# EAGLE design wirelesscontroller (EAGLE 6.5.0)
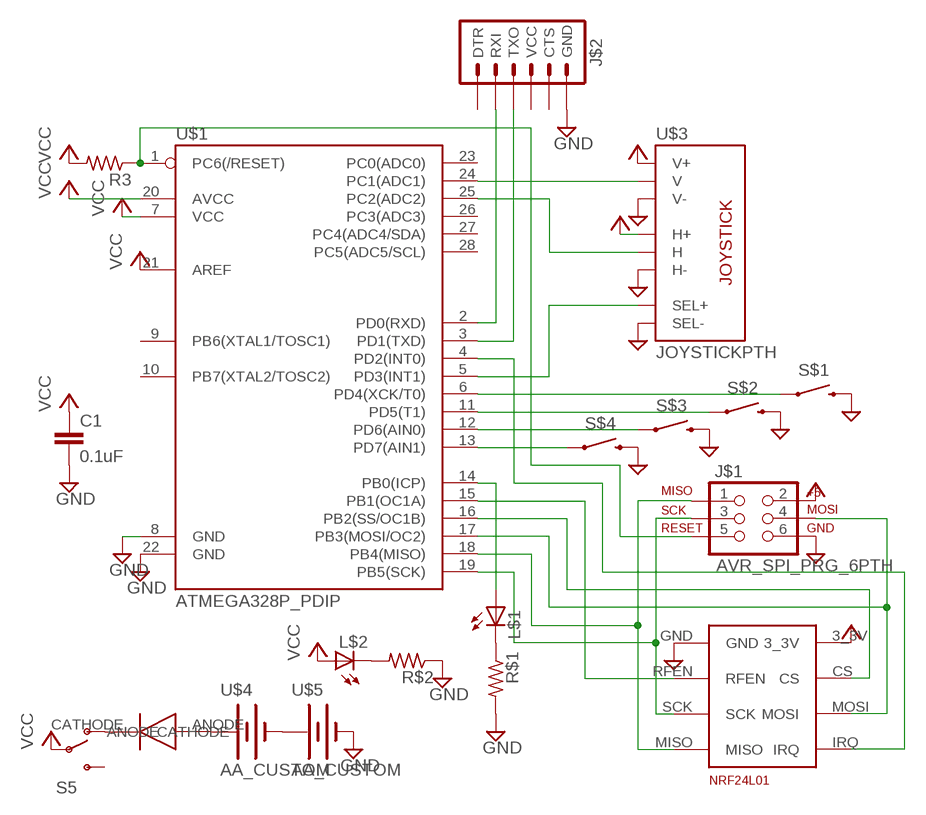
[diagram p0: schematic, sheet 1]

## Parts
C1  0.1uF  0.1UF-25V(+80/-20%)(0603)  [0603-CAP]
D$1  DIODE  [R0603]
J$1  AVR_SPI_PRG_6PTH  [2X3]
J$2  ARDUINO_SERIAL_PROGRAMPTH  [1X06]
L$1  LEDCHIPLED_0603  [CHIPLED_0603]
L$2  LEDCHIPLED_0603  [CHIPLED_0603]
R3  R-US_R0603  [R0603]
R$1  R-US_R0603  [R0603]
R$2  R-US_R0603  [R0603]
S5  SWITCH-SPDTPTH  [SWITCH-SPDT]
S$1  SWITCH-MOMENTARY-212MM  [TACTILE-PTH-12MM]
S$2  SWITCH-MOMENTARY-212MM  [TACTILE-PTH-12MM]
S$3  SWITCH-MOMENTARY-212MM  [TACTILE-PTH-12MM]
S$4  SWITCH-MOMENTARY-212MM  [TACTILE-PTH-12MM]
U$1  ATMEGA328P_PDIP  [DIL28-3]
U$2  NRF24L01_BRK  [4X2]
U$3  JOYSTICKPTH  [JOYSTICK]
U$4  AA_CUSTOM  [AACLIP]
U$5  AA_CUSTOM  [AACLIP]

## Nets
AX: U$1.25(PC2(ADC2)) U$3.H2(H)
AY: U$1.24(PC1(ADC1)) U$3.V2(V)
B1: S$1.1 U$1.6(PD4(XCK/T0))
B2: S$2.1 U$1.11(PD5(T1))
B3: S$3.1 U$1.12(PD6(AIN0))
B4: S$4.1 U$1.13(PD7(AIN1))
B5: U$1.5(PD3(INT1)) U$3.B1A(SEL+)
CS: U$1.16(PB2(SS/OC1B)) U$2.CS
GND: C1.2 J$1.6 J$2.6(GND) R$1.2 R$2.1 S$1.3 S$2.3 S$3.3 S$4.3 U$1.8(GND) U$1.22(GND) U$2.GND U$3.B2A(SEL-) U$3.H3(H-) U$3.V3(V-) U$5.-
MISO: J$1.1 U$1.18(PB4(MISO)) U$2.MISO
MOSI: J$1.4 U$1.17(PB3(MOSI/OC2)) U$2.MOSI
N$1: D$1.CATHODE S5.1(O)
N$2: U$4.- U$5.+
N$3: D$1.ANODE U$4.+
N$6: L$2.C R$2.2
N$7: L$1.C R$1.1
N$8: L$1.A U$1.14(PB0(ICP))
RESET: J$1.5 R3.1 U$1.1(PC6(/RESET))
RF_IRQ: U$1.4(PD2(INT0)) U$2.IRQ
RFEN: U$1.15(PB1(OC1A)) U$2.RFEN
RX: J$2.2(RXI) U$1.2(PD0(RXD))
SCK: J$1.3 U$1.19(PB5(SCK)) U$2.SCK
TX: J$2.3(TXO) U$1.3(PD1(TXD))
VCC: C1.1 J$1.2 L$2.A R3.2 S5.2(P) U$1.7(VCC) U$1.20(AVCC) U$1.21(AREF) U$2.3_3V U$3.H1(H+) U$3.V1(V+)
Unconnected: J$2.1(DTR) J$2.4(VCC) J$2.5(CTS) S5.3(S) U$1.9(PB6(XTAL1/TOSC1)) U$1.10(PB7(XTAL2/TOSC2)) U$1.23(PC0(ADC0)) U$1.26(PC3(ADC3)) U$1.27(PC4(ADC4/SDA)) U$1.28(PC5(ADC5/SCL))

## Library data of the parts
C1 = SparkFun-Capacitors:0.1UF-25V(+80/-20%)(0603): CAP-00810 Ceramic Standard decoupling cap; PROD_ID: CAP-00810
D$1 = battery:DIODE
J$1 = SparkFun-Connectors:AVR_SPI_PRG_6: AVR ISP 6 Pin This is the reduced ISP connector for AVR programming. Common on Arduino. This footprint will take up less PCB space and can be used with a 10-pin to 6-pin adapter such as SKU: BOB-08508
J$2 = SparkFun-Connectors:ARDUINO_SERIAL_PROGRAM: FTDI connector footprints
L$1 L$2 = led:LED: LED OSRAM: - CHIPLED LG R971, LG N971, LY N971, LG Q971, LY Q971, LO R971, LY R971 LH N974, LH R974 LS Q976, LO Q976, LY Q976 LO Q996 - Hyper CHIPLED LW Q18S LB Q993, LB Q99A, LB R99A - SideLED LS A670, LO A670, LY A670, LG A670, LP A670 LB A673, LV A673, LT A673, LW A673 LH A674 LY A675 LS A676, LA A676, LO A676, LY A676, LW A676 LS A679, LY A679, LG A679 - Hyper Micro SIDELED® LS Y876, LA Y876, LO Y876, LY Y876 LT Y87S - SmartLED LW L88C, LW L88S LB L89C, LB L89S, LG L890 LS L89K, LO L89K, LY L89K LS L896, LA L896, LO L896, LY L896 - TOPLED LS T670, LO T670, LY T670, LG T670, LP T670 LSG T670, LSP T670, LSY T670, LOP T670, LYG T670 LG T671, LOG T671, LSG T671 LB T673, LV T673, LT T673, LW T673 LH T674 LS T676, LA T676, LO T676, LY T676, LB T676, LH T676, LSB T676, LW T676 LB T67C, LV T67C, LT T67C, LS T67K, LO T67K, LY T67K, LW E67C LS E67B, LA E67B, LO E67B, LY E67B, LB E67C, LV E67C, LT E67C LW T67C LS T679, LY T679, LG T679 LS T770, LO T770, LY T770, LG T770, LP T770 LB T773, LV T773, LT T773, LW T773 LH T774 LS E675, LA E675, LY E675, LS T675 LS T776, LA T776, LO T776, LY T776, LB T776 LHGB T686 LT T68C, LB T68C - Hyper Mini TOPLED® LB M676 - Mini TOPLED Santana® LG M470 LS M47K, LO M47K, LY M47K Source: http://www.osram.convergy.de LUXEON: - LUMILED® LXK2-PW12-R00, LXK2-PW12-S00, LXK2-PW14-U00, LXK2-PW14-V00 LXK2-PM12-R00, LXK2-PM12-S00, LXK2-PM14-U00 LXK2-PE12-Q00, LXK2-PE12-R00, LXK2-PE12-S00, LXK2-PE14-T00, LXK2-PE14-U00 LXK2-PB12-K00, LXK2-PB12-L00, LXK2-PB12-M00, LXK2-PB14-N00, LXK2-PB14-P00, LXK2-PB14-Q00 LXK2-PR12-L00, LXK2-PR12-M00, LXK2-PR14-Q00, LXK2-PR14-R00 LXK2-PD12-Q00, LXK2-PD12-R00, LXK2-PD12-S00 LXK2-PH12-R00, LXK2-PH12-S00 LXK2-PL12-P00, LXK2-PL12-Q00, LXK2-PL12-R00 Source: www.luxeon.com KINGBRIGHT: KA-3528ASYC Source: www.kingbright.com
R3 R$1 R$2 = resistor:R-US_: RESISTOR, American symbol
S5 = SparkFun-Electromechanical:SWITCH-SPDT: SPDT Switch Simple slide switch, Spark Fun Electronics SKU : COM-00102 DPDT SMT slide switch, AYZ0202, SWCH-08179
S$1-S$4 = SparkFun-Electromechanical:SWITCH-MOMENTARY-2: Various NO switches- pushbuttons, reed, etc; PROD_ID: SWCH-09185
U$1 = SparkFun-DigitalIC:ATMEGA328P_PDIP: uC used in the Arduino 32kb flash, 1k EEPROM, 2k SRAM This is the through-hole version of this chip.
U$2 = NRF:NRF24L01_BRK
U$3 = SparkFun-Electromechanical:JOYSTICK: Thumb Joystick Joystick commonly found in PS2 controllers. Two pots and a select switch. Footprint proven. Spark Fun Electronics SKU : COM-09032
U$4 U$5 = battery:AA_CUSTOM

## Board
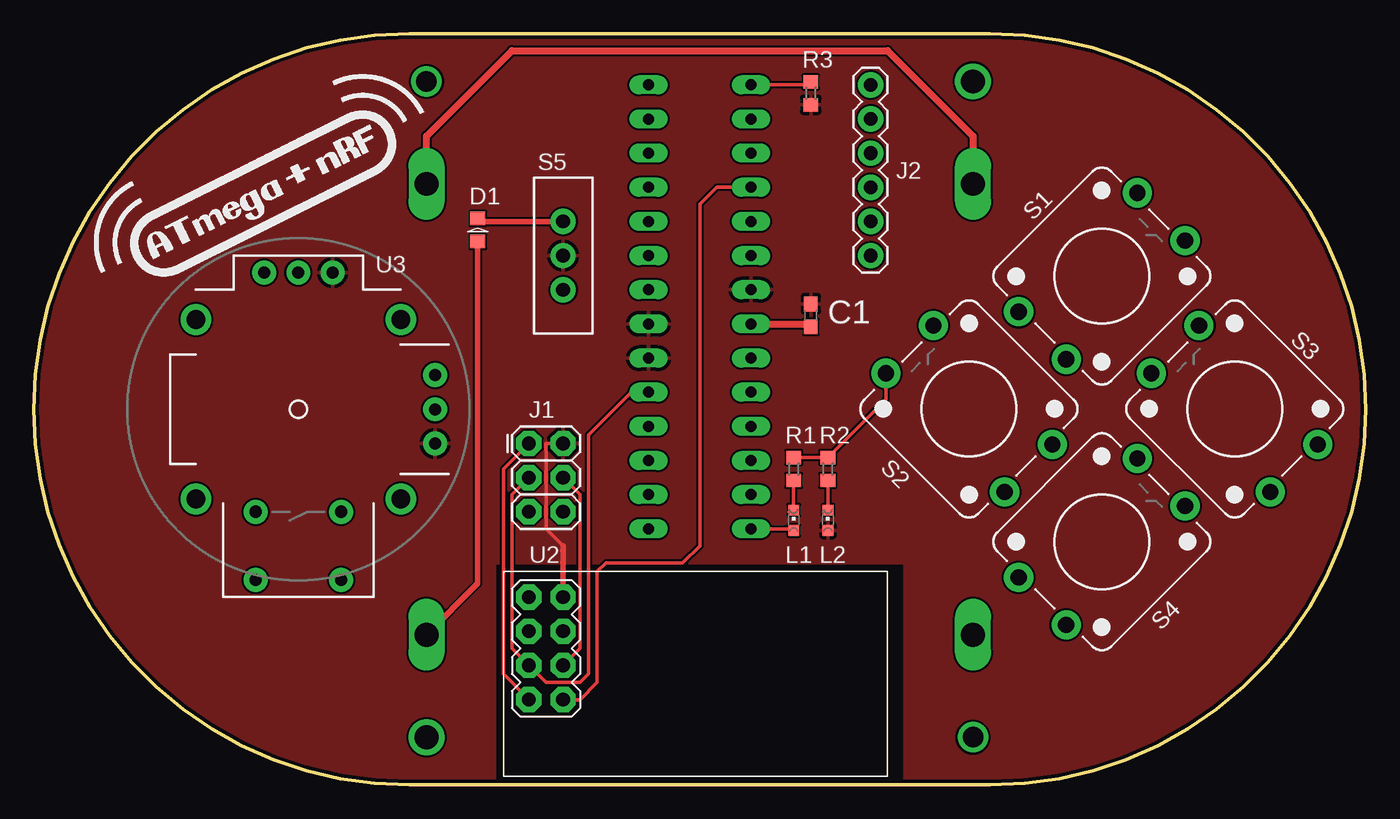
[diagram p1: board, top side]
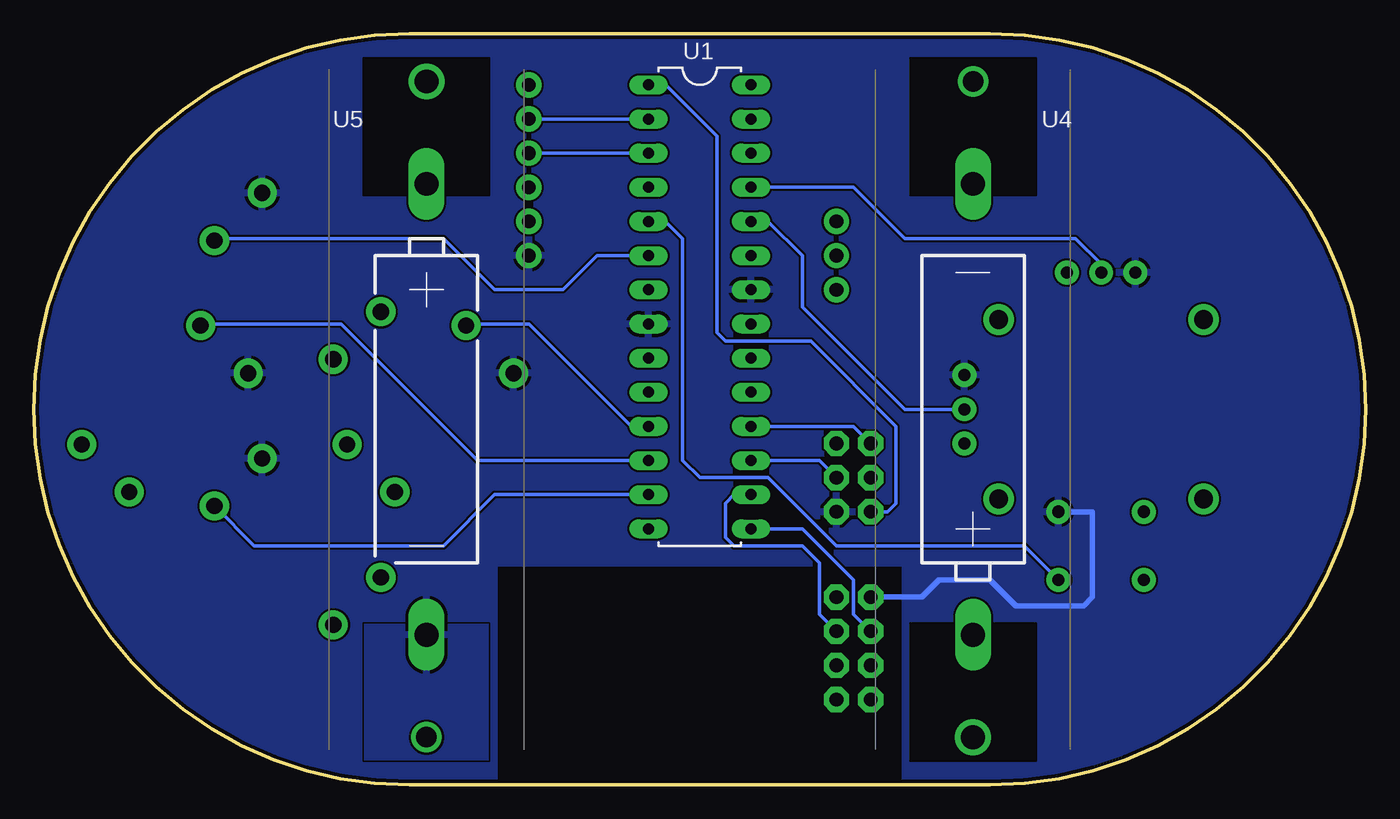
[diagram p2: board, bottom side, seen from below]

Size 99.06 x 55.88 mm. Coordinates in mm from the lower left corner, seen from the top.
Outline: 71.12,0 arc90 99.06,27.94 arc90 71.12,55.88 27.94,55.88 arc90 0,27.94 arc90 27.94,0 71.12,0
Copper layers (1*16): Top 0.035mm / dielectric 1.5mm / Bottom 0.035mm
Design rules "DFRobot_Eagle_Rule_v0.4": minimum track width 6mil, minimum drill 12mil, track to track 6mil, track to pad 6mil, pad to pad 6mil, via to via 6mil, smd to smd 0mil, copper to edge 10mil, drill to drill 10mil, minimum pad ring 12mil, minimum via ring 8mil, stop-mask expansion 2mil, vias tented up to drill 25mil, thermal gap 10mil

### Footprints (pad centres in the part's own frame; a part is rotated, then mirrored left to right if it is on the bottom)
0603-CAP = smd 1.1 x 1: 1 -0.85,0; 2 0.85,0
R0603 = smd 1 x 1.1: ANODE -0.85,0; CATHODE 0.85,0
2X3 = drill 1.016 pad 1.88 octagon: 1 0,0; 2 0,2.54; 3 2.54,0; 4 2.54,2.54; 5 5.08,0; 6 5.08,2.54
1X06 = drill 1.016 pad 1.88: 1 0,0; 2 2.54,0; 3 5.08,0; 4 7.62,0; 5 10.16,0; 6 12.7,0
CHIPLED_0603 = smd 0.8 x 0.8: A 0,-0.75; C 0,0.75
R0603' = smd 1 x 1.1: 1 -0.85,0; 2 0.85,0
SWITCH-SPDT = drill 1.016 pad 1.88: 1 0,2.54; 2 0,0; 3 0,-2.54
TACTILE-PTH-12MM = drill 1.2 pad 2.159: 1 6.25,-2.5; 2 -6.25,-2.5; 3 6.25,2.5; 4 -6.25,2.5
DIL28-3 = drill 0.813 long: 1 -16.51,-3.81; 2 -13.97,-3.81; 3 -11.43,-3.81; 4 -8.89,-3.81; 5 -6.35,-3.81; 6 -3.81,-3.81; 7 -1.27,-3.81; 8 1.27,-3.81; 9 3.81,-3.81; 10 6.35,-3.81; 11 8.89,-3.81; 12 11.43,-3.81; 13 13.97,-3.81; 14 16.51,-3.81; 15 16.51,3.81; 16 13.97,3.81; 17 11.43,3.81; 18 8.89,3.81; 19 6.35,3.81; 20 3.81,3.81; 21 1.27,3.81; 22 -1.27,3.81; 23 -3.81,3.81; 24 -6.35,3.81; 25 -8.89,3.81; 26 -11.43,3.81; 27 -13.97,3.81; 28 -16.51,3.81
4X2 = drill 1.016 pad 1.88 octagon: 3_3V -3.81,1.27; CS -1.27,1.27; GND -3.81,-1.27; IRQ 3.81,1.27; MISO 3.81,-1.27; MOSI 1.27,1.27; RFEN -1.27,-1.27; SCK 1.27,-1.27
JOYSTICK = drill 0.9 pad 1.778: B1A -3.175,12.7; B1B 3.175,12.7; B2A -3.175,7.62; B2B 3.175,7.62 | drill 0.889 pad 1.778: H1 -2.54,-10.16; H2 0,-10.16; H3 2.54,-10.16; V1 -10.16,2.54; V2 -10.16,0; V3 -10.16,-2.54 | drill 1.397 pad 2.286: MOUNT1 -7.62,6.668; MOUNT2 -7.62,-6.668; MOUNT3 7.62,-6.668; MOUNT4 7.62,6.668
AACLIP = drill 1.778 long: + -16.764,0; - 16.764,0 | drill 1.778: MECH+ -24.384,0 | drill 1.524: MECH- 24.384,0

### Placement (x,y rotation side)
C1  57.78,34.92 270 top
D$1  33.02,41.27 90 top
J$1  36.83,25.4 270 top
J$2  62.23,52.07 270 top
L$1  56.52,19.68 0 top
L$2  59.05,19.68 0 top
R3  [R0603']  57.78,51.44 270 top
R$1  [R0603']  56.52,23.5 90 top
R$2  [R0603']  59.05,23.5 270 top
S5  39.37,39.37 0 top
S$1  79.43,37.85 45 top
S$2  69.55,27.97 135 top
S$3  89.31,27.97 135 top
S$4  79.43,18.09 45 top
U$1  49.53,35.56 270 bottom
U$2  38.1,10.16 270 top
U$3  19.68,27.94 180 top
U$4  29.21,27.94 90 bottom
U$5  69.85,27.94 270 bottom

### Tracks (layer width: path | path; a pad name or v marks a point on that pad's centre or on a via)
AX
  Bottom 0.254: U$3.H2 19.68,38.73 21.59,40.64 34.29,40.64 38.1,44.45 U$1.25
AY
  Bottom 0.254: U$3.V2 34.29,27.94 41.91,35.56 41.91,39.37 44.45,41.91 U$1.24
B1
  Bottom 0.254: U$1.6 57.15,39.37 59.69,36.83 64.77,36.83 68.58,40.64 85.47,40.64 S$1.1
B2
  Bottom 0.254: U$1.11 54.61,26.67 62.23,34.29 66.76,34.29 S$2.1
B3
  Bottom 0.254: U$1.12 66.04,24.13 76.2,34.29 86.52,34.29 S$3.1
B4
  Bottom 0.254: U$1.13 64.77,21.59 68.58,17.78 82.65,17.78 S$4.1
B5
  Bottom 0.254: U$3.B1A 25.4,17.78 39.37,17.78 44.45,22.86 49.53,22.86 50.8,24.13 50.8,40.64 52.07,41.91 U$1.5
CS
  Bottom 0.254: U$2.CS 40.64,12.7 40.64,16.51 41.91,17.78 46.99,17.78 47.62,18.41 47.62,20.95 46.99,21.59 U$1.16
GND
  Top 0.254: R$1.2 R$2.1 63.36,28.65 S$2.3
  Top 0.406: 57.78,34.29 C1.2
  Top 0.508: U$1.8 57.78,34.29
  Bottom 0.406: U$2.GND 33.02,13.97 31.75,15.24 27.94,15.24 26.04,13.34 20.95,13.34 20.32,13.97 20.32,20.32 U$3.B2A
  pour Bottom: 0,0 0,55.88 99.06,55.88 99.06,0 64.77,0 64.77,16.51 34.29,16.51 34.29,0
MISO
  Top 0.254: U$2.MISO 34.92,8.26 34.92,23.5 J$1.1
  Bottom 0.254: U$1.18 38.1,26.67 J$1.1
MOSI
  Top 0.254: U$2.MOSI 40.64,10.16 40.64,21.59 J$1.4
  Bottom 0.254: U$1.17 40.64,24.13 J$1.4
N$1
  Top 0.406: S5.1 33.23,41.91 D$1.CATHODE
N$2
  Top 0.508: U$4.- 29.21,48.26 35.56,54.61 63.5,54.61 69.85,48.26 U$5.+
N$3
  Top 0.406: D$1.ANODE 33.02,14.99 U$4.+
N$6
  Top 0.254: L$2.C R$2.2
N$7
  Top 0.254: L$1.C R$1.1
N$8
  Top 0.254: U$1.14 56.4,19.05 L$1.A
RESET
  Top 0.254: U$1.1 57.78,52.07 R3.1
  Bottom 0.254: J$1.5 35.56,20.32 34.92,20.95 34.92,26.67 41.27,33.02 47.62,33.02 48.26,33.66 48.26,48.26 52.07,52.07 U$1.1
RF_IRQ
  Top 0.254: U$2.IRQ 40.64,6.35 41.91,7.62 41.91,15.88 42.55,16.51 48.26,16.51 49.53,17.78 49.53,43.18 50.8,44.45 U$1.4
RFEN
  Bottom 0.254: U$2.RFEN 38.1,12.7 38.1,15.24 41.91,19.05 U$1.15
RX
  Bottom 0.254: J$2.2 U$1.2
SCK
  Top 0.254: J$1.3 35.56,21.59 35.56,10.16 U$2.SCK 38.1,7.62 40.64,7.62 41.27,8.26 41.27,26.04 44.45,29.21 U$1.19
TX
  Bottom 0.254: J$2.3 U$1.3
VCC
  Top 0.254: J$1.2 38.1,25.4 38.1,19.05 39.37,17.78
  Top 0.406: 39.37,17.78 U$2.3_3V
  pour Top: 0,0 0,55.88 99.06,55.88 99.06,0 64.77,0 64.77,16.51 34.29,16.51 34.29,0

### Text on the board
tPlace: R3 | S5 | J2 | D1 | S1 | U3 | C1 | S3 | J1 | R1 | R2 | S2 | U2 | L1 | L2 | S4
bPlace: U1 | U4 | U5